# Altium project VESC.PrjPCB
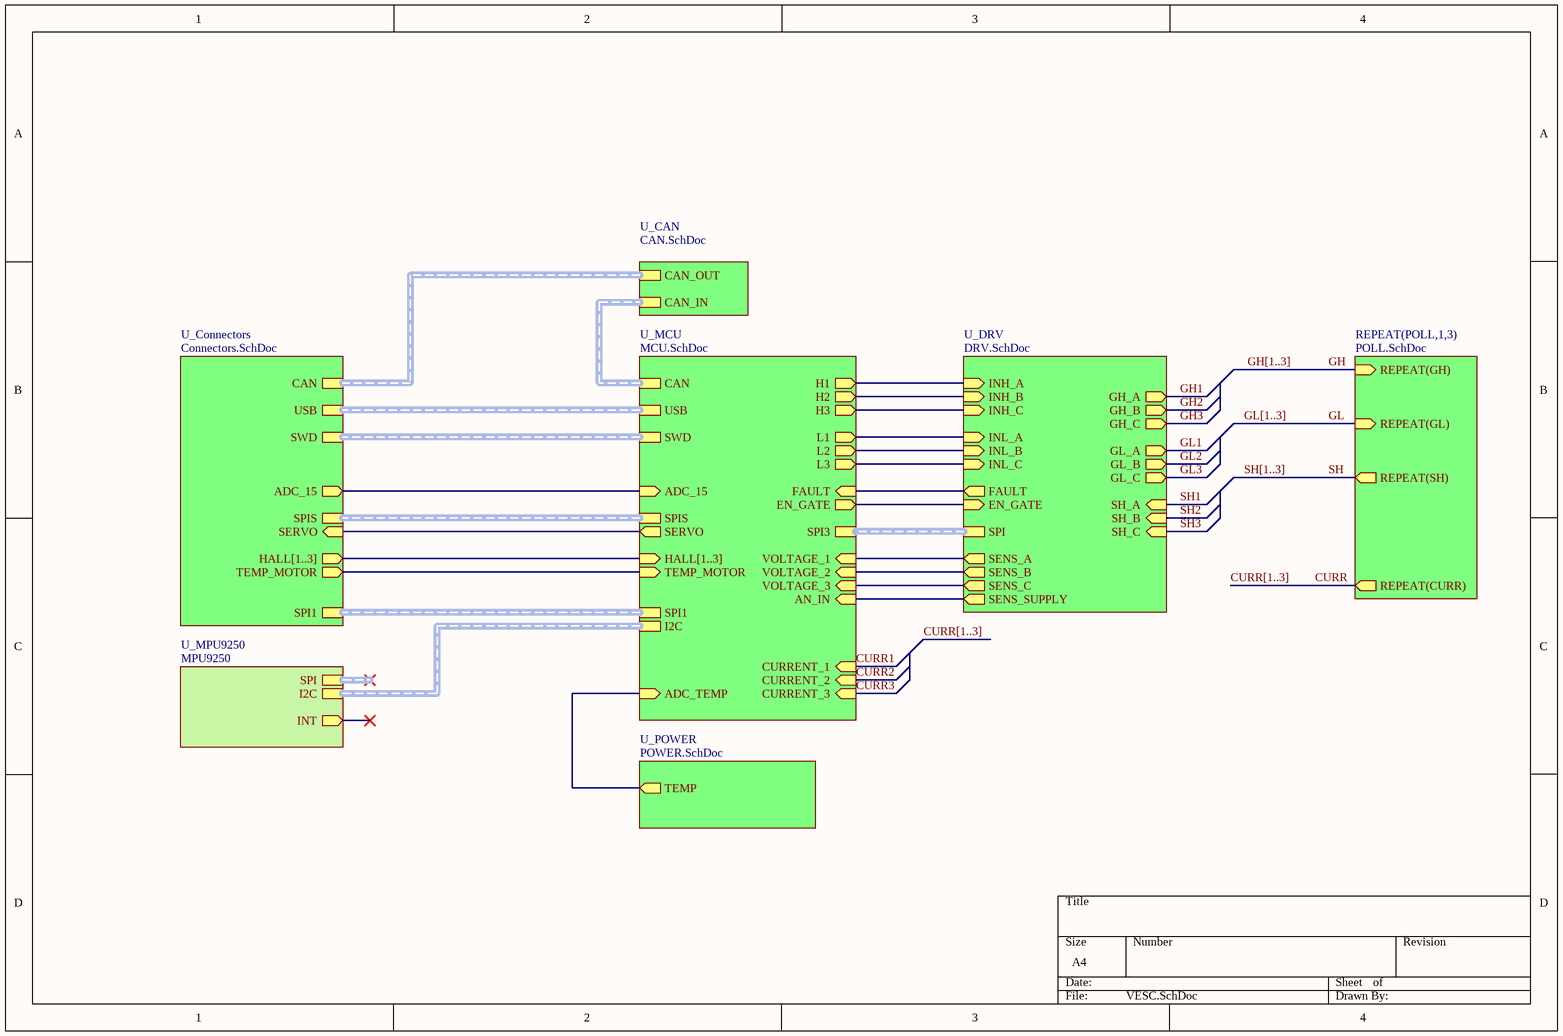
[diagram p0: VESC.SchDoc]
7 sheets, 124 parts. Net scope: hierarchical (ports join the sheet entries above them; power ports are global).
Board file: Vesc.PcbDoc
Sheets:
  VESC.SchDoc
    U_MCU = MCU.SchDoc
    U_DRV = DRV.SchDoc
    POLL1 = POLL.SchDoc
    POLL2 = POLL.SchDoc
    POLL3 = POLL.SchDoc
    U_CAN = CAN.SchDoc
    U_Connectors = Connectors.SchDoc
    U_POWER = POWER.SchDoc

## Sheet VESC.SchDoc
size A4

### Sub-sheets
REPEAT(POLL,1,3) = POLL.SchDoc: REPEAT(GH) (in), REPEAT(GL) (in), REPEAT(SH) (out), REPEAT(CURR) (out)
U_CAN = CAN.SchDoc: CAN_IN (harness CAN Input), CAN_OUT (harness CAN Output)
U_Connectors = Connectors.SchDoc: SERVO (in), SWD, USB, CAN (harness CAN Output), SPI1 (harness SPI), ADC_15 (out), HALL[1..3] (out), TEMP_MOTOR (out), SPIS (harness SPI)
U_DRV = DRV.SchDoc: INH_A (in), INH_B (in), INH_C (in), INL_A (in), INL_B (in), INL_C (in), SPI (harness SPI), SENS_A (out), SENS_B (out), SENS_C (out), SENS_SUPPLY (out), EN_GATE (in), FAULT (out), GH_A (out), GH_B (out), GH_C (out), GL_A (out), GL_B (out), GL_C (out), SH_A (in), SH_B (in), SH_C (in)
U_MCU = MCU.SchDoc: SERVO (out), SPI1 (harness SPI), SWD (harness SWD), USB (harness USB), CAN (harness CAN Input), H1 (out), H2 (out), H3 (out), L1 (out), L2 (out), L3 (out), FAULT (in), EN_GATE (out), VOLTAGE_1 (in), VOLTAGE_2 (in), VOLTAGE_3 (in), AN_IN (in), SPI3 (harness SPI), ADC_15 (in), HALL[1..3] (in), TEMP_MOTOR (in), CURRENT_1 (in), CURRENT_2 (in), CURRENT_3 (in), SPIS (harness SPI), ADC_TEMP (in), I2C (harness I2C)
U_MPU9250 = MPU9250 (file not in this document): INT (out), SPI (harness SPI), I2C (harness SPI)
U_POWER = POWER.SchDoc: TEMP (out)

### Nets
CURR: sheet REPEAT(POLL,1,3)/REPEAT(CURR)
GH: sheet REPEAT(POLL,1,3)/REPEAT(GH)
GL: sheet REPEAT(POLL,1,3)/REPEAT(GL)
SH: sheet REPEAT(POLL,1,3)/REPEAT(SH)
NetC36_2: sheet U_MCU/ADC_TEMP, sheet U_POWER/TEMP
NetC58_1: sheet U_MCU/TEMP_MOTOR, sheet U_Connectors/TEMP_MOTOR
NetJP4_8: sheet U_MCU/ADC_15, sheet U_Connectors/ADC_15
NetJP6_3: sheet U_MCU/SERVO, sheet U_Connectors/SERVO
NetR15_1: sheet U_MCU/AN_IN, sheet U_DRV/SENS_SUPPLY
NetR17_1: sheet U_MCU/VOLTAGE_1, sheet U_DRV/SENS_A
NetR19_1: sheet U_MCU/VOLTAGE_2, sheet U_DRV/SENS_B
NetR21_1: sheet U_MCU/VOLTAGE_3, sheet U_DRV/SENS_C
NetU1_34: sheet U_MCU/L1, sheet U_DRV/INL_A
NetU1_35: sheet U_MCU/L2, sheet U_DRV/INL_B
NetU1_36: sheet U_MCU/L3, sheet U_DRV/INL_C
NetU1_41: sheet U_MCU/H1, sheet U_DRV/INH_A
NetU1_42: sheet U_MCU/H2, sheet U_DRV/INH_B
NetU1_43: sheet U_MCU/H3, sheet U_DRV/INH_C
NetU1_57: sheet U_MCU/EN_GATE, sheet U_DRV/EN_GATE
NetU1_59: sheet U_MCU/FAULT, sheet U_DRV/FAULT

### Buses and harness runs
bus CURR[1..3]
bus GH[1..3]
bus GL[1..3]
bus SH[1..3]
bus sheet U_Connectors/HALL[1..3] = sheet U_MCU/HALL[1..3]
harness sheet U_CAN/CAN_IN = sheet U_MCU/CAN
harness sheet U_CAN/CAN_OUT = sheet U_Connectors/CAN
harness sheet U_Connectors/SPI1 = sheet U_MCU/SPI1
harness sheet U_Connectors/SPIS = sheet U_MCU/SPIS
harness sheet U_Connectors/SWD = sheet U_MCU/SWD
harness sheet U_Connectors/USB = sheet U_MCU/USB
harness sheet U_DRV/SPI = sheet U_MCU/SPI3
harness sheet U_MCU/I2C = sheet U_MPU9250/I2C

## Sheet MCU.SchDoc
size A4
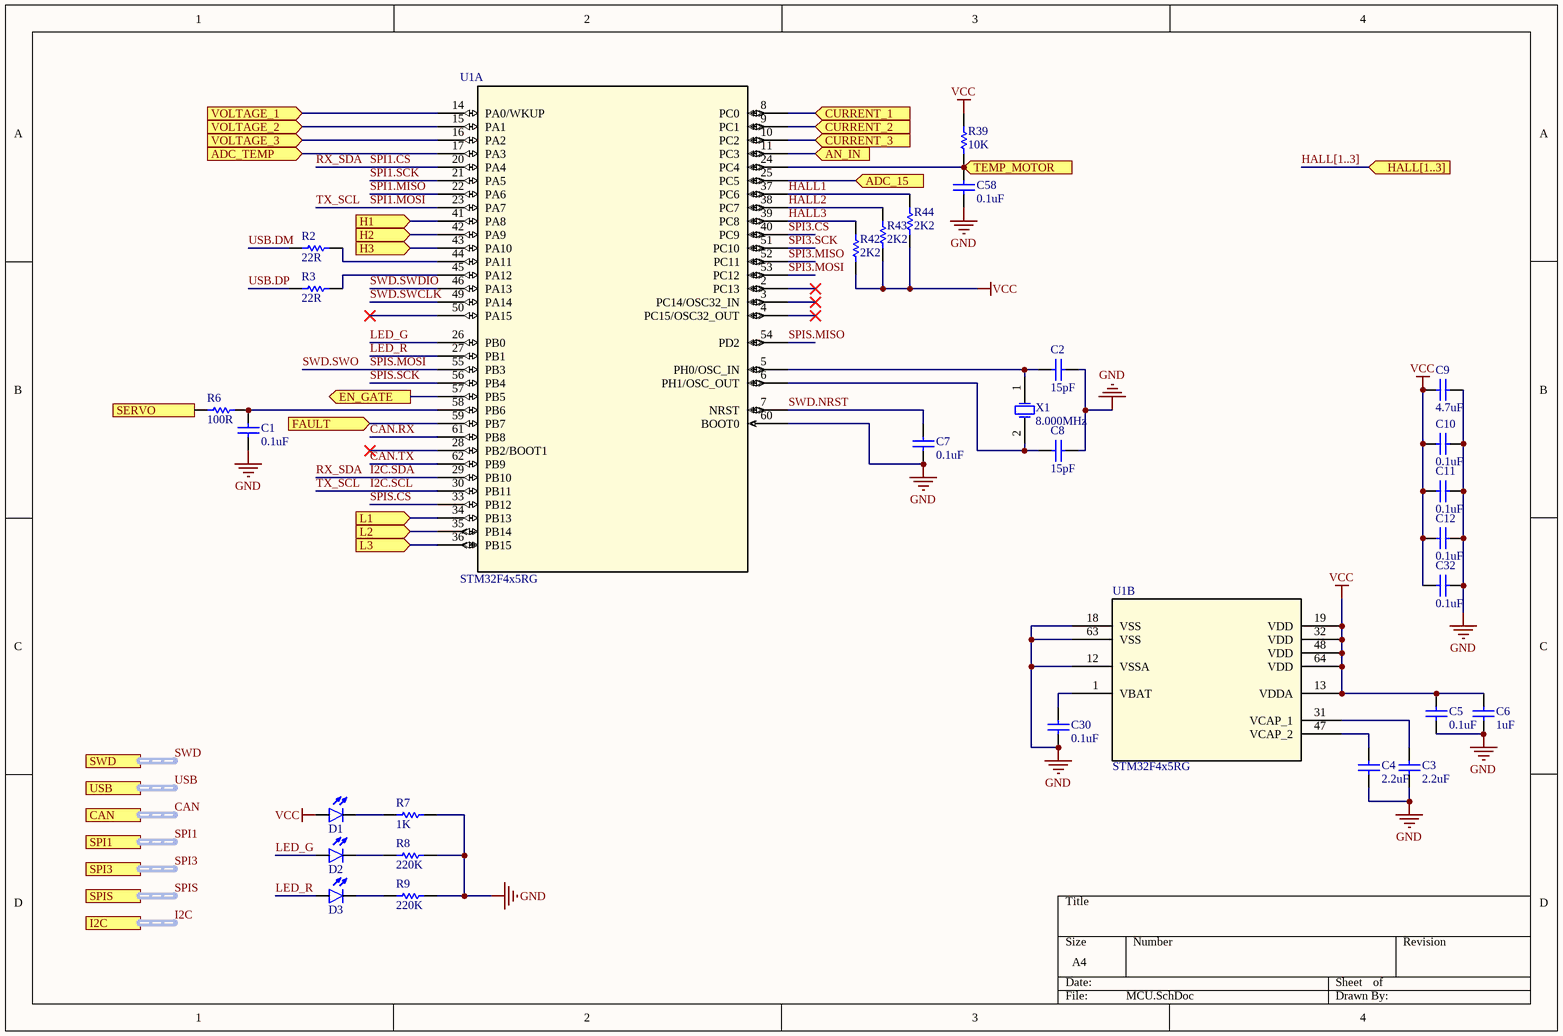
[diagram p1: MCU.SchDoc]

### Parts
C1  value 0.1uF  [C0603[1608X92]]  (hidden comment: 0.1uF 16V 0603)
C2  value 15pF  [C0603[1608X92]]  (hidden comment: 15pF 6.3V 0603)
C3  value 2.2uF  [C1206[3216X160]]  (hidden comment: 2.2uF 6.3V 1206)
C4  value 2.2uF  [C1206[3216X160]]  (hidden comment: 2.2uF 6.3V 1206)
C5  value 0.1uF  [C0603[1608X92]]  (hidden comment: 0.1uF 6.3V 0603)
C6  value 1uF  [C0603[1608X92]]  (hidden comment: 1uF 6.3V 0603)
C7  value 0.1uF  [C0603[1608X92]]  (hidden comment: 0.1uF 6.3V 0603)
C8  value 15pF  [C0603[1608X92]]  (hidden comment: 15pF 6.3V 0603)
C9  value 4.7uF  [C0603[1608X92]]  (hidden comment: 4.7uF 6.3V 0603)
C10  value 0.1uF  [C0603[1608X92]]  (hidden comment: 0.1uF 6.3V 0603)
C11  value 0.1uF  [C0603[1608X92]]  (hidden comment: 0.1uF 6.3V 0603)
C12  value 0.1uF  [C0603[1608X92]]  (hidden comment: 0.1uF 6.3V 0603)
C30  value 0.1uF  [C0603[1608X92]]  (hidden comment: 0.1uF 6.3V 0603)
C32  value 0.1uF  [C0603[1608X92]]  (hidden comment: 0.1uF 6.3V 0603)
C58  value 0.1uF  [C0603[1608X92]]  (hidden comment: 0.1uF 6.3V 0603)
D1  LED_0603_BLUE_5mA  [LED0603]  (value not drawn)
D2  LED_0603_GREEN_5mA  [LED0603]  (value not drawn)
D3  LED_0603_ORANGE_5mA  [LED0603]  (value not drawn)
R2  value 22R  [R0603[1608]]  (hidden comment: 22R 1% 0603)
R3  value 22R  [R0603[1608]]  (hidden comment: 22R 1% 0603)
R6  value 100R  [R0603[1608]]  (hidden comment: 100R 1% 0603)
R7  value 1K  [R0603[1608]]  (hidden comment: 1K 1% 0603)
R8  value 220K  [R0603[1608]]  (hidden comment: 220K 1% 0603)
R9  value 220K  [R0603[1608]]  (hidden comment: 220K 1% 0603)
R39  value 10K  [R0603[1608]]  (hidden comment: 10K 1% 0603)
R42  value 2K2  [R0603[1608]]  (hidden comment: 2K2 1% 0603)
R43  value 2K2  [R0603[1608]]  (hidden comment: 2K2 1% 0603)
R44  value 2K2  [R0603[1608]]  (hidden comment: 2K2 1% 0603)
U1  STM32F4x5RG  [LQFP64-10x10mm]  (parts A,B of 2)
X1  8.000MHz  [OSC_2SM_3R2x2R5]

### Ports
ADC_15 (in), ADC_TEMP (in), AN_IN (in), CAN (harness CAN Input), CURRENT_1 (in), CURRENT_2 (in), CURRENT_3 (in), EN_GATE (out), FAULT (in), H1 (in), H2 (in), H3 (in), HALL[1..3] (in), I2C (harness I2C), L1 (in), L2 (in), L3 (in), SERVO (out), SPI1 (harness SPI), SPI3 (harness SPI), SPIS (harness SPI), SWD (harness SWD), TEMP_MOTOR (in), USB (harness USB), VOLTAGE_1 (in), VOLTAGE_2 (in), VOLTAGE_3 (in)

### Nets
GND: C1.1 C2.2 C3.1 C4.1 C5.2 C6.2 C7.2 C8.2 C9.2 C10.2 C11.2 C12.2 C30.1 C32.2 C58.2 R7.2 R8.2 R9.2 U1.12(VSSA) U1.18(VSS) U1.60(BOOT0) U1.63(VSS)
VCC: C5.1 C6.1 C9.1 C10.1 C11.1 C12.1 C32.1 D1.A R39.2 R42.1 R43.1 R44.1 U1.13(VDDA) U1.19(VDD) U1.32(VDD) U1.48(VDD) U1.64(VDD)
CAN.RX: U1.61(PB8)
CAN.TX: U1.62(PB9)
CURR1: U1.8(PC0) ; port CURRENT_1
CURR2: U1.9(PC1) ; port CURRENT_2
CURR3: U1.10(PC2) ; port CURRENT_3
HALL1: R44.2 U1.37(PC6)
HALL2: R43.2 U1.38(PC7)
HALL3: R42.2 U1.39(PC8)
I2C.SCL: U1.23(PA7) U1.30(PB11)  [also labelled SPI1.MOSI, TX_SCL]
I2C.SDA: U1.20(PA4) U1.29(PB10)  [also labelled RX_SDA, SPI1.CS]
LED_G: D2.A U1.26(PB0)
LED_R: D3.A U1.27(PB1)
SPI1.MISO: U1.22(PA6)
SPI1.SCK: U1.21(PA5)
SPI3.CS: U1.40(PC9)
SPI3.MISO: U1.52(PC11)
SPI3.MOSI: U1.53(PC12)
SPI3.SCK: U1.51(PC10)
SPIS.CS: U1.33(PB12)
SPIS.MISO: U1.54(PD2)
SPIS.MOSI: U1.55(PB3)  [also labelled SWD.SWO]
SPIS.SCK: U1.56(PB4)
SWD.NRST: C7.1 U1.7(NRST)
SWD.SWCLK: U1.49(PA14)
SWD.SWDIO: U1.46(PA13)
USB.DM: R2.1
USB.DP: R3.1
NetC1_2: C1.2 R6.2 U1.58(PB6)
NetC2_1: C2.1 U1.5(PH0/OSC_IN) X1.1(OSC1)
NetC3_2: C3.2 U1.31(VCAP_1)
NetC4_2: C4.2 U1.47(VCAP_2)
NetC8_1: C8.1 U1.6(PH1/OSC_OUT) X1.2(OSC2)
NetC30_2: C30.2 U1.1(VBAT)
NetC36_2: U1.17(PA3) ; port ADC_TEMP
NetC58_1: C58.1 R39.1 U1.24(PC4) ; port TEMP_MOTOR
NetD1_C: D1.C R7.1
NetD2_C: D2.C R8.1
NetD3_C: D3.C R9.1
NetJP4_8: U1.25(PC5) ; port ADC_15
NetJP6_3: R6.1 ; port SERVO
NetR2_2: R2.2 U1.44(PA11)
NetR3_2: R3.2 U1.45(PA12)
NetR15_1: U1.11(PC3) ; port AN_IN
NetR17_1: U1.14(PA0/WKUP) ; port VOLTAGE_1
NetR19_1: U1.15(PA1) ; port VOLTAGE_2
NetR21_1: U1.16(PA2) ; port VOLTAGE_3
NetU1_34: U1.34(PB13) ; port L1
NetU1_35: U1.35(PB14) ; port L2
NetU1_36: U1.36(PB15) ; port L3
NetU1_41: U1.41(PA8) ; port H1
NetU1_42: U1.42(PA9) ; port H2
NetU1_43: U1.43(PA10) ; port H3
NetU1_57: U1.57(PB5) ; port EN_GATE
NetU1_59: U1.59(PB7) ; port FAULT

Not connected (* = marked no-connect by the designer): U1 2(PC13)* 3(PC14/OSC32_IN)* 4(PC15/OSC32_OUT)* 28(PB2/BOOT1)* 50(PA15)*

### Buses and harness runs
bus HALL[1..3] = port HALL[1..3]
harness CAN = port CAN
harness I2C = port I2C
harness SPI1 = port SPI1
harness SPI3 = port SPI3
harness SPIS = port SPIS
harness SWD = port SWD
harness USB = port USB

### Library data of the parts
C1 = CAP_0.1uF_16V_0603_10%: 0.1uF 16V 10% 0603 (1608 Metric); PartNumber: GCM188R71C104KA37D; Manufacturer: Murata; TemperatureCoefficient: X7R; Mounting Technology: Surface Mount; PackageReference: 0603; PackageDescription: 0603 (1608 Metric); Voltage: 16V; Tolerance: 10%
C2 C8 = CAP_15pF_6.3V_0603_1%: 15pF 6.3V 1% 0603 (1608 Metric); PartNumber: CBR02C150F9GAC; Manufacturer: KEMET; TemperatureCoefficient: C0G; Mounting Technology: Surface Mount; PackageReference: 0603; PackageDescription: 0603 (1608 Metric); Voltage: 6.3V; Tolerance: 1%
C3 C4 = CAP_2.2uF_16V_1206_10%: 2.2uF 6.3V 10% 1206 (3216 Metric); PartNumber: GRM31CR60J476KE19L; Manufacturer: Murata; Voltage: 16V; Mounting Technology: Surface Mount; PackageReference: 1206; PackageDescription: 1206 (3216 Metric); Tolerance: 10%
C5 C7 C10-C12 C30 C32 C58 = CAP_0.1uF_6.3V_0603_10%: 0.1uF 6.3V 10% 0603 (1608 Metric); PartNumber: GRM188R70J104KA01D; Manufacturer: Murata; Mounting Technology: Surface Mount; PackageReference: 0603; PackageDescription: 0603 (1608 Metric); Voltage: 6.3V; Tolerance: 10%
C6 = CAP_1uF_6.3V_0603_10%: 1uF 6.3V 10% 0603 (1608 Metric); PartNumber: GRM188R60J105KA01D; Manufacturer: Murata; TemperatureCoefficient: X5R; Mounting Technology: Surface Mount; PackageReference: 0603; PackageDescription: 0603 (1608 Metric); Voltage: 6.3V; Tolerance: 10%
C9 = CAP_4.7uF_6.3V_0603_10%: 4.7uF 6.3V 10% 0603 (1608 Metric); PartNumber: GRM188R60J475KE19D; Manufacturer: Murata; TemperatureCoefficient: X5R; Mounting Technology: Surface Mount; PackageReference: 0603; PackageDescription: 0603 (1608 Metric); Voltage: 6.3V; Tolerance: 10%
D1 = LED_0603_BLUE_5mA: PartNumber: LTST-C193TBKT-5A; Manufacturer: Lite-On Inc.; PackageReference: 0603; PackageDescription: 0603 (1608 Metric); Mounting Technology: Surface Mount
D2 = LED_0603_GREEN_5mA: PartNumber: LTST-C193TGKT-5A; Manufacturer: Lite-On Inc.; PackageReference: 0603; PackageDescription: 0603 (1608 Metric); Mounting Technology: Surface Mount
D3 = LED_0603_ORANGE_5mA: PartNumber: LTST-C193KFKT-5A; Manufacturer: Lite-On Inc.; PackageReference: 0603; PackageDescription: 0603 (1608 Metric); Mounting Technology: Surface Mount
R2 R3 = RES_22R_0603_1%: 22R 0.25W 1% 0603 (1005 Metric); Manufacturer: Vishay / Dale; PartNumber: CRCW060322R0FKEAHP; Tolerance: 1%; Power: 0.25W; Mounting Technology: Surface Mount; PackageReference: 0603; PackageDescription: 0603 (1608 Metric); ComponentLink1Description: Datasheet; ComponentLink1URL: http://www.vishay.com/docs/20043/crcwhpe3.pdf
R6 = RES_100R_0603_1%: 100R 0.25W 1% 0603 (1005 Metric); Manufacturer: Vishay / Dale; PartNumber: CRCW0603100RFKEAHP; Tolerance: 1%; Power: 0.25W; Mounting Technology: Surface Mount; PackageReference: 0603; PackageDescription: 0603 (1608 Metric); ComponentLink1Description: Datasheet; ComponentLink1URL: http://www.vishay.com/docs/20043/crcwhpe3.pdf
R7 = RES_1K_0603_1%: 1K 0.25W 1% 0603 (1005 Metric); Manufacturer: Vishay / Dale; PartNumber: CRCW06031K00FKEAHP; Tolerance: 1%; Power: 0.25W; Mounting Technology: Surface Mount; PackageReference: 0603; PackageDescription: 0603 (1608 Metric); ComponentLink1Description: Datasheet; ComponentLink1URL: http://www.vishay.com/docs/20043/crcwhpe3.pdf
R8 R9 = RES_220K_0603_1%: 220K 0.25W 1% 0603 (1005 Metric); Manufacturer: Vishay / Dale; PartNumber: CRCW0603220KJNEAHP; Tolerance: 1%; Power: 0.25W; Mounting Technology: Surface Mount; PackageReference: 0603; PackageDescription: 0603 (1608 Metric); ComponentLink1Description: Datasheet; ComponentLink1URL: http://www.vishay.com/docs/20043/crcwhpe3.pdf
R39 = RES_10K_0603_1%: 10K 0.25W 1% 0603 (1005 Metric); Manufacturer: Vishay; PartNumber: RCS060310K0FKEA; Tolerance: 1%; Power: 0.25W; Mounting Technology: Surface Mount; PackageReference: 0603; PackageDescription: 0603 (1608 Metric); ComponentLink1Description: Datasheet; ComponentLink1URL: http://www.vishay.com/docs/20065/rcse3.pdf
R42-R44 = RES_2K2_0603_1%: 2K2 0.25W 1% 0603 (1005 Metric); Manufacturer: Vishay / Dale; PartNumber: CRCW06032K20FKEAHP; Tolerance: 1%; Power: 0.25W; Mounting Technology: Surface Mount; PackageReference: 0603; PackageDescription: 0603 (1608 Metric); ComponentLink1Description: Datasheet; ComponentLink1URL: http://www.vishay.com/docs/20043/crcwhpe3.pdf
U1 = STM32F4x5RG: Imported; PartNumber: STM32F405RG; Vendor: STMicroelectronics; Value: Value; Type: Type; RefDes: RefDes; Manufacturer: STMicroelectronics
X1 = XTAL: Crystal Oscillator; Manufacturer: NX; PartNumber: NX3225GD-8.000M-EXS00A-CG04874; PackageReference: R38; Value: 8.000MHz

## Sheet DRV.SchDoc
size A4
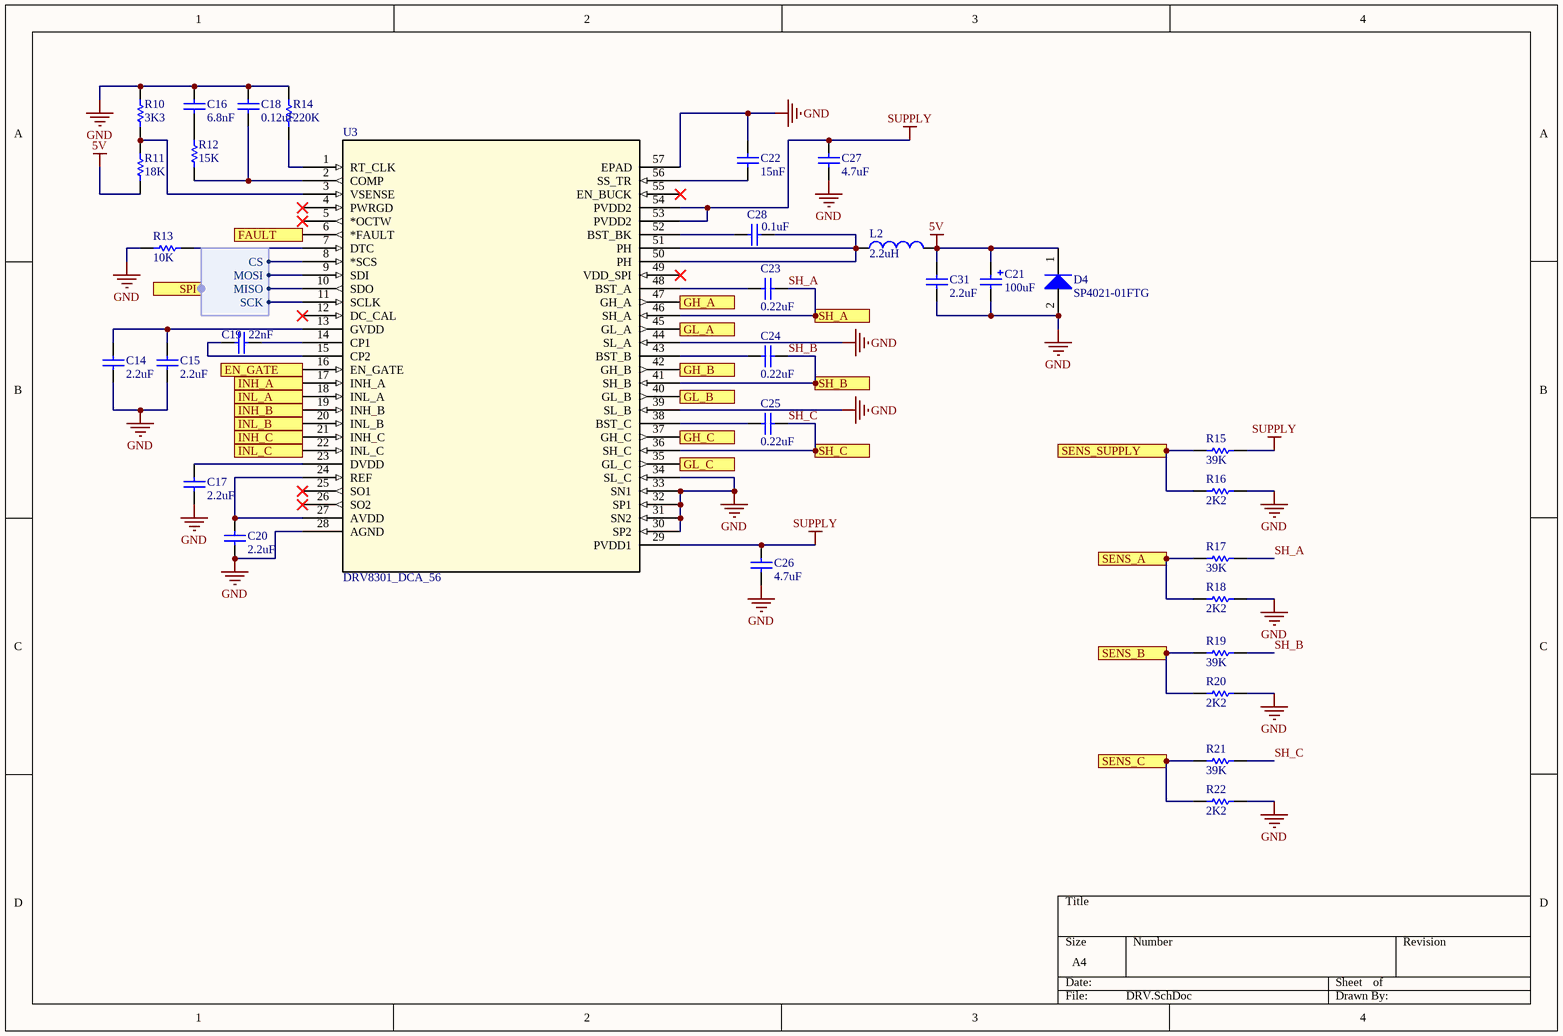
[diagram p2: DRV.SchDoc]

### Parts
C14  value 2.2uF  [C0603[1608X92]]  (hidden comment: 2.2uF 25V 0603)
C15  value 2.2uF  [C0603[1608X92]]  (hidden comment: 2.2uF 25V 0603)
C16  value 6.8nF  [C0603[1608X92]]  (hidden comment: 6.8nF 50V 0603)
C17  value 2.2uF  [C0603[1608X92]]  (hidden comment: 2.2uF 25V 0603)
C18  value 0.12uF  [C0603[1608X92]]  (hidden comment: 0.12uF 10V 0603)
C19  value 22nF  [C0603[1608X92]]  (hidden comment: 22nF 50V 0603)
C20  value 2.2uF  [C0603[1608X92]]  (hidden comment: 2.2uF 25V 0603)
C21  value 100uF  [C1206[3216X105]_Tantal]  (hidden comment: 100uF 16V 1206)
C22  value 15nF  [C0603[1608X92]]  (hidden comment: 15nF 50V 0603)
C23  value 0.22uF  [C0603[1608X92]]  (hidden comment: 0.22uF 50V 0603)
C24  value 0.22uF  [C0603[1608X92]]  (hidden comment: 0.22uF 50V 0603)
C25  value 0.22uF  [C0603[1608X92]]  (hidden comment: 0.22uF 50V 0603)
C26  value 4.7uF  [C1210[3225X200]]  (hidden comment: 4.7uF 100V 1210)
C27  value 4.7uF  [C1210[3225X200]]  (hidden comment: 4.7uF 100V 1210)
C28  value 0.1uF  [C0603[1608X92]]  (hidden comment: 0.1uF 50V 0603)
C31  value 2.2uF  [C1206[3216X160]]  (hidden comment: 2.2uF 6.3V 1206)
D4  SP4021-01FTG  [SOD-323]
L2  value 2.2uH  [XAL8080]  (hidden comment: XAL8080-220ME_)
R10  value 3K3  [R0603[1608]]  (hidden comment: 4K7 1% 0603)
R11  value 18K  [R0603[1608]]  (hidden comment: 18K 1% 0603)
R12  value 15K  [R0603[1608]]  (hidden comment: 15K 1% 0603)
R13  value 10K  [R0603[1608]]  (hidden comment: 10K 1% 0603)
R14  value 220K  [R0603[1608]]  (hidden comment: 220K 1% 0603)
R15  value 39K  [R0603[1608]]  (hidden comment: 39K 1% 0603)
R16  value 2K2  [R0603[1608]]  (hidden comment: 2K2 1% 0603)
R17  value 39K  [R0603[1608]]  (hidden comment: 39K 1% 0603)
R18  value 2K2  [R0603[1608]]  (hidden comment: 2K2 1% 0603)
R19  value 39K  [R0603[1608]]  (hidden comment: 39K 1% 0603)
R20  value 2K2  [R0603[1608]]  (hidden comment: 2K2 1% 0603)
R21  value 39K  [R0603[1608]]  (hidden comment: 39K 1% 0603)
R22  value 2K2  [R0603[1608]]  (hidden comment: 2K2 1% 0603)
U3  DRV8301_DCA_56  [DCA56_6P35X3P61]

### Ports
EN_GATE (in), FAULT (out), GH_A (out), GH_B (out), GH_C (out), GL_A (out), GL_B (out), GL_C (out), INH_A (in), INH_B (in), INH_C (in), INL_A (in), INL_B (in), INL_C (in), SENS_A (out), SENS_B (out), SENS_C (out), SENS_SUPPLY (out), SH_A (in), SH_B (in), SH_C (in), SPI (harness SPI)

### Harnesses
SPI: SCK, MOSI, MISO, CS

### Nets
5V: C21.1 C31.1 D4.1(K) L2.2 R11.1
GND: C14.1 C15.1 C16.2 C17.1 C18.2 C20.1 C21.2 C22.2 C26.1 C27.2 C31.2 D4.2(A) R10.2 R13.1 R14.2 R16.2 R18.2 R20.2 R22.2 U3.28(AGND) U3.30(SP2) U3.31(SN2) U3.32(SP1) U3.33(SN1) U3.34(SL_C) U3.39(SL_B) U3.44(SL_A) U3.57(EPAD)
SUPPLY: C26.2 C27.1 R15.2 U3.29(PVDD1) U3.53(PVDD2) U3.54(PVDD2)
GH1: U3.47(GH_A) ; port GH_A
GH2: U3.42(GH_B) ; port GH_B
GH3: U3.37(GH_C) ; port GH_C
GL1: U3.45(GL_A) ; port GL_A
GL2: U3.40(GL_B) ; port GL_B
GL3: U3.35(GL_C) ; port GL_C
SH_A: C23.2 R17.2 U3.46(SH_A) ; port SH_A  [project net SH1]
SH_B: C24.2 R19.2 U3.41(SH_B) ; port SH_B  [project net SH2]
SH_C: C25.2 R21.2 U3.36(SH_C) ; port SH_C  [project net SH3]
SPI3.CS: U3.8(*SCS) ; port SPI.CS
SPI3.MISO: U3.10(SDO) ; port SPI.MISO
SPI3.MOSI: U3.9(SDI) ; port SPI.MOSI
SPI3.SCK: U3.11(SCLK) ; port SPI.SCK
NetC14_2: C14.2 C15.2 U3.13(GVDD)
NetC16_1: C16.1 R12.2
NetC17_2: C17.2 U3.23(DVDD)
NetC18_1: C18.1 R12.1 U3.2(COMP)
NetC19_1: C19.1 U3.14(CP1)
NetC19_2: C19.2 U3.15(CP2)
NetC20_2: C20.2 U3.24(REF) U3.27(AVDD)
NetC22_1: C22.1 U3.56(SS_TR)
NetC23_1: C23.1 U3.48(BST_A)
NetC24_1: C24.1 U3.43(BST_B)
NetC25_1: C25.1 U3.38(BST_C)
NetC28_1: C28.1 L2.1 U3.50(PH) U3.51(PH)
NetC28_2: C28.2 U3.52(BST_BK)
NetR10_1: R10.1 R11.2 U3.3(VSENSE)
NetR13_2: R13.2 U3.7(DTC)
NetR14_1: R14.1 U3.1(RT_CLK)
NetR15_1: R15.1 R16.1 ; port SENS_SUPPLY
NetR17_1: R17.1 R18.1 ; port SENS_A
NetR19_1: R19.1 R20.1 ; port SENS_B
NetR21_1: R21.1 R22.1 ; port SENS_C
NetU1_34: U3.18(INL_A) ; port INL_A
NetU1_35: U3.20(INL_B) ; port INL_B
NetU1_36: U3.22(INL_C) ; port INL_C
NetU1_41: U3.17(INH_A) ; port INH_A
NetU1_42: U3.19(INH_B) ; port INH_B
NetU1_43: U3.21(INH_C) ; port INH_C
NetU1_57: U3.16(EN_GATE) ; port EN_GATE
NetU1_59: U3.6(*FAULT) ; port FAULT

Not connected (* = marked no-connect by the designer): U3 4(PWRGD)* 5(*OCTW)* 12(DC_CAL)* 25(SO1)* 26(SO2)* 49(VDD_SPI)* 55(EN_BUCK)*

### Library data of the parts
C14 C15 C17 C20 = CAP_2.2uF_25V_0603_10%: 2.2uF 25V 10% 0603 (1608 Metric); PartNumber: GRM188R61E225KA12D; Manufacturer: Murata; TemperatureCoefficient: X5R; Mounting Technology: Surface Mount; PackageReference: 0603; PackageDescription: 0603 (1608 Metric); Voltage: 25V; Tolerance: 10%
C16 = CAP_6.8nF_50V_0603_5%: 6.8nF 50V 5% 0603 (1608 Metric); PartNumber: GRM1885C1H682JA01D; Manufacturer: Murata; TemperatureCoefficient: C0G; Mounting Technology: Surface Mount; PackageReference: 0603; PackageDescription: 0603 (1608 Metric); Voltage: 50V; Tolerance: 5%
C18 = CAP_0.12uF_10V_0603_10%: 0.12uF 10V 10% 0603 (1608 Metric); PartNumber: GRM188R71A124KA01D; Manufacturer: Murata; TemperatureCoefficient: X7R; Mounting Technology: Surface Mount; PackageReference: 0603; PackageDescription: 0603 (1608 Metric); Voltage: 10V; Tolerance: 10%
C19 = CAP_22nF_50V_0603_10%: 22nF 50V 10% 0603 (1608 Metric); PartNumber: GRM188R71H223KA01D; Manufacturer: Murata; TemperatureCoefficient: X7R; Mounting Technology: Surface Mount; PackageReference: 0603; PackageDescription: 0603 (1608 Metric); Voltage: 50V; Tolerance: 10%
C21 = CAP_100uF_16V_1206_20%: TANTAL 100uF 16V 20% 1206 (3216 Metric); PartNumber: F931C107MCCAJ6; Manufacturer: AVX Corporation; Mounting Technology: Surface Mount; PackageReference: 1206; PackageDescription: 1206 (3216 Metric); Voltage: 16V; Tolerance: 20%
C22 = CAP_15nF_50V_0603_5%: 15nF 50V 5% 0603 (1608 Metric); PartNumber: GRM188R71H153JA01D; Manufacturer: Murata; TemperatureCoefficient: X7R; Mounting Technology: Surface Mount; PackageReference: 0603; PackageDescription: 0603 (1608 Metric); Voltage: 50V; Tolerance: 5%
C23-C25 = CAP_0.22uF_50V_0603_10%: 0.22uF 50V 10% 0603 (1608 Metric); PartNumber: GRM188R61H224KAC4D; Manufacturer: Murata; TemperatureCoefficient: X7R; Mounting Technology: Surface Mount; PackageReference: 0603; PackageDescription: 0603 (1608 Metric); Voltage: 50V; Tolerance: 10%
C26 C27 = CAP_4.7uF_100V_1210_10%: 4.7uF 100V 10% 1210 (3225 Metric); PartNumber: GRJ32DC72A475KE11L; Manufacturer: Murata; Mounting Technology: Surface Mount; PackageReference: 1210; PackageDescription: 1210 (3225 Metric); Voltage: 100V; Tolerance: 10%
C28 = CAP_0.1uF_50V_0603_10%: 0.1uF 50V 10% 0603 (1608 Metric); PartNumber: GCM188R71H104KA57D; Manufacturer: Murata; TemperatureCoefficient: X7R; Mounting Technology: Surface Mount; PackageReference: 0603; PackageDescription: 0603 (1608 Metric); Voltage: 50V; Tolerance: 10%
C31 = CAP_2.2uF_16V_1206_10%: as C3 on sheet MCU; Mounting Technology: Surface Mount; PackageReference: 1206; PackageDescription: 1206 (3216 Metric); Tolerance: 10%
D4 = SP4021-01FTG: Manufacturer: Littelfuse; PartNumber: SP4021-01FTG; PackageReference: SOD-323-2; Mounting Technology: Surface Mount
L2 = XAL8080-220ME_: 2.2uH 38A 4.08mOhms; PartNumber: XAL8080-270MED; Manufacturer: Coilcraft; Published: 8-Jun-2000; PackageReference: 0402-A; Publisher: Altium Limited; PackageDescription: Chip Inductor
R10 = RES_3K3_0603_1%: 3K3 0.25W 1% 0603 (1005 Metric); Manufacturer: Vishay / Dale; PartNumber: CRCW06033K30FKEAHP; Tolerance: 1%; Power: 0.25W; Mounting Technology: Surface Mount; PackageReference: 0603; PackageDescription: 0603 (1608 Metric); ComponentLink1Description: Datasheet; ComponentLink1URL: http://www.vishay.com/docs/20043/crcwhpe3.pdf
R11 = RES_18K_0603_1%: 18K 0.25W 1% 0603 (1005 Metric); Manufacturer: Vishay / Dale; PartNumber: CRCW060318K0FKEAHP; Tolerance: 1%; Power: 0.25W; Mounting Technology: Surface Mount; PackageReference: 0603; PackageDescription: 0603 (1608 Metric); ComponentLink1Description: Datasheet; ComponentLink1URL: http://www.vishay.com/docs/20043/crcwhpe3.pdf
R12 = RES_15K_0603_1%: 15K 0.25W 1% 0603 (1005 Metric); Manufacturer: Vishay / Dale; PartNumber: CRCW060315K0FKEAHP; Tolerance: 1%; Power: 0.25W; Mounting Technology: Surface Mount; PackageReference: 0603; PackageDescription: 0603 (1608 Metric); ComponentLink1Description: Datasheet; ComponentLink1URL: http://www.vishay.com/docs/20043/crcwhpe3.pdf
R13 = RES_10K_0603_1%: as R39 on sheet MCU; Tolerance: 1%; Power: 0.25W; Mounting Technology: Surface Mount; PackageReference: 0603; PackageDescription: 0603 (1608 Metric); ComponentLink1Description: Datasheet; ComponentLink1URL: http://www.vishay.com/docs/20065/rcse3.pdf
R14 = RES_220K_0603_1%: as R8 on sheet MCU; Tolerance: 1%; Power: 0.25W; Mounting Technology: Surface Mount; PackageReference: 0603; PackageDescription: 0603 (1608 Metric); ComponentLink1Description: Datasheet; ComponentLink1URL: http://www.vishay.com/docs/20043/crcwhpe3.pdf
R15 R17 R19 R21 = RES_39K_0603_1%: 39K 0.25W 1% 0603 (1005 Metric); Manufacturer: Vishay / Dale; PartNumber: CRCW060339K0FKEAHP; Tolerance: 1%; Power: 0.25W; Mounting Technology: Surface Mount; PackageReference: 0603; PackageDescription: 0603 (1608 Metric); ComponentLink1Description: Datasheet; ComponentLink1URL: http://www.vishay.com/docs/20043/crcwhpe3.pdf
R16 R18 R20 R22 = RES_2K2_0603_1%: as R42 on sheet MCU; Tolerance: 1%; Power: 0.25W; Mounting Technology: Surface Mount; PackageReference: 0603; PackageDescription: 0603 (1608 Metric); ComponentLink1Description: Datasheet; ComponentLink1URL: http://www.vishay.com/docs/20043/crcwhpe3.pdf
U3 = DRV8301_DCA_56: Imported; Manufacturer: Texas Instruments; FAMILY_NAME: 3-PHASE BRUSHLESS PRE-DRIVER; PIN_COUNT: 56; PACKAGE_DESIGNATOR: DCA; Datasheet_URL: http://www.ti.com/lit/gpn/DRV8301; GENERIC_PART_NUMBER: DRV8301; Vendor: Texas Instruments; Value: Value; Type: Type; RefDes: RefDes; PackageReference: HTSSOP; PartNumber: DRV8301_DCA

## Sheet POLL.SchDoc
size A4
Used 3 times, as channels POLL1, POLL2, POLL3. Parts and nets are listed once, with the designators drawn on the sheet.
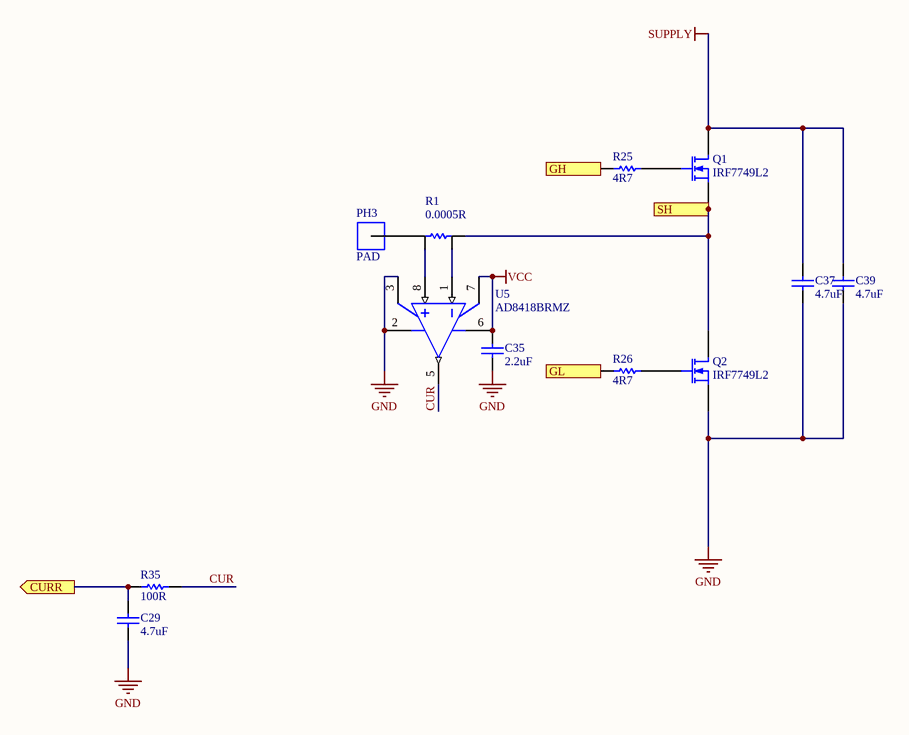
[diagram p3: POLL.SchDoc]

### Parts
C29  value 4.7uF  [C0603[1608X92]]  (hidden comment: 4.7uF 6.3V 0603)
C35  value 2.2uF  [C0603[1608X92]]  (hidden comment: 2.2uF 6.3V 0603)
C37  value 4.7uF  [C1210[3225X200]]  (hidden comment: 4.7uF 100V 1210)
C39  value 4.7uF  [C1210[3225X200]]  (hidden comment: 4.7uF 100V 1210)
PH3  PAD  [PAD]
Q1  IRF7749L2  [DIRECTFET-9]
Q2  IRF7749L2  [DIRECTFET-9]
R1  value 0.0005R  [LRMAP3920B]  (hidden comment: LRMAP3920B)
R25  value 4R7  [R0603[1608]]  (hidden comment: 4R7 1% 0603)
R26  value 4R7  [R0603[1608]]  (hidden comment: 4R7 1% 0603)
R35  value 100R  [R0603[1608]]  (hidden comment: 100R 1% 0603)
U5  AD8418BRMZ  [MSOP-8]

### Ports
CURR (out), GH (in), GL (in), SH

### Nets
GND: C29.1 C35.2 C37.1 C39.1 Q2.2(S) U5.2(GND) U5.3(VREF2)
SUPPLY: C37.2 C39.2 Q1.3(D)
VCC: C35.1 U5.6(VS) U5.7(VREF1)
CUR: R35.2 U5.5(OUT)
CURR: C29.2 R35.1 ; port CURR
GH: R25.1 ; port GH
GL: R26.1 ; port GL
SH: Q1.2(S) Q2.3(D) R1.2 ; port SH
NetPH3_0: PH3.0(PH) R1.1
NetQ1_1: Q1.1(G) R25.2
NetQ2_1: Q2.1(G) R26.2
NetR1_3: R1.3 U5.8(IN+)
NetR1_4: R1.4 U5.1(IN-)

### Channels
POLL1: designators C29=POLL1_C29 C35=POLL1_C35 C37=POLL1_C37 C39=POLL1_C39 PH3=POLL1_PH3 Q1=POLL1_Q1 Q2=POLL1_Q2 R1=POLL1_R1 R25=POLL1_R25 R26=POLL1_R26 R35=POLL1_R35 U5=POLL1_U5; ports CURR=CURR1 GH=GH1 GL=GL1 SH=SH1
POLL2: designators C29=POLL2_C29 C35=POLL2_C35 C37=POLL2_C37 C39=POLL2_C39 PH3=POLL2_PH3 Q1=POLL2_Q1 Q2=POLL2_Q2 R1=POLL2_R1 R25=POLL2_R25 R26=POLL2_R26 R35=POLL2_R35 U5=POLL2_U5; ports CURR=CURR2 GH=GH2 GL=GL2 SH=SH2
POLL3: designators C29=POLL3_C29 C35=POLL3_C35 C37=POLL3_C37 C39=POLL3_C39 PH3=POLL3_PH3 Q1=POLL3_Q1 Q2=POLL3_Q2 R1=POLL3_R1 R25=POLL3_R25 R26=POLL3_R26 R35=POLL3_R35 U5=POLL3_U5; ports CURR=CURR3 GH=GH3 GL=GL3 SH=SH3

### Library data of the parts
C29 = CAP_4.7uF_6.3V_0603_10%: as C9 on sheet MCU; Mounting Technology: Surface Mount; PackageReference: 0603; PackageDescription: 0603 (1608 Metric); Voltage: 6.3V; Tolerance: 10%
C35 = CAP_2.2uF_6.3V_0603_10%: 2.2uF 6.3V 10% 0603 (1608 Metric); PartNumber: GRM185R60J225KE26D; Manufacturer: Murata; TemperatureCoefficient: X5R; Mounting Technology: Surface Mount; PackageReference: 0603; PackageDescription: 0603 (1608 Metric); Voltage: 6.3V; Tolerance: 10%
C37 C39 = CAP_4.7uF_100V_1210_10%: as C26 on sheet DRV; Mounting Technology: Surface Mount; PackageReference: 1210; PackageDescription: 1210 (3225 Metric); Voltage: 100V; Tolerance: 10%
Q1 Q2 = IRF7749L2: N-Channel MOSFET; PartNumber: IRF7749L1TRPBF; Manufacturer: Infineon Technologies; PackageReference: DIRECTFET L8; PackageDescription: DirectFET™ Isometric L8; Mounting Technology: Surface Mount
R1 = LRMAP3920B: Current Sense Resistor, 0.0005R; Manufacturer: IRC / TT Electronics; Power: 5W; Tolerance: 1%; PartNumber: LRMAP3920B; PackageReference: 2726; Mounting Technology: Surface Mount
R25 R26 = RES_4R7_0603_1%: 4R7 0.25W 1% 0603 (1005 Metric); Manufacturer: Vishay / Dale; PartNumber: CRCW06034R70JNEAHP; Tolerance: 1%; Power: 0.25W; Mounting Technology: Surface Mount; PackageReference: 0603; PackageDescription: 0603 (1608 Metric); ComponentLink1Description: Datasheet; ComponentLink1URL: http://www.vishay.com/docs/20043/crcwhpe3.pdf
R35 = RES_100R_0603_1%: as R6 on sheet MCU; Tolerance: 1%; Power: 0.25W; Mounting Technology: Surface Mount; PackageReference: 0603; PackageDescription: 0603 (1608 Metric); ComponentLink1Description: Datasheet; ComponentLink1URL: http://www.vishay.com/docs/20043/crcwhpe3.pdf
U5 = AD8418BRMZ: Current Sense Amplifiers Zero Drift ,Precision Current Sense AMP; Manufacturer: Analog Devices; PartNumber: AD8418BRMZ; Mounting Technology: Surface Mount; PackageReference: MSOP-8; PackageDescription: SOP, 8-Leads, Body 3x3mm, Pitch 0.65mm, IPC Medium Density

## Sheet CAN.SchDoc
size A4
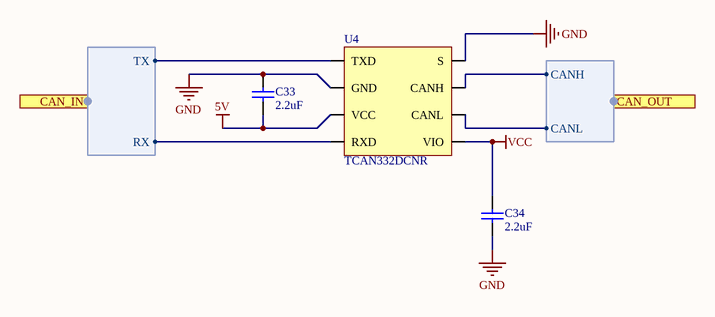
[diagram p4: CAN.SchDoc]

### Parts
C33  value 2.2uF  [C0603[1608X92]]  (hidden comment: 2.2uF 6.3V 0603)
C34  value 2.2uF  [C0603[1608X92]]  (hidden comment: 2.2uF 6.3V 0603)
U4  TCAN332DCNR  [SOT-23-8]

### Ports
CAN_IN (harness CAN Input), CAN_OUT (harness CAN Output)

### Harnesses
CAN Input: TX, RX
CAN Output: CANH, CANL

### Nets
5V: C33.1 U4.3(VCC)
GND: C33.2 C34.1 U4.2(GND) U4.8(S)
VCC: C34.2 U4.5(VIO)
CAN.RX: U4.4(RXD) ; port CAN_IN.RX
CAN.TX: U4.1(TXD) ; port CAN_IN.TX
NetJP2_2: U4.6(CANL) ; port CAN_OUT.CANL
NetJP2_3: U4.7(CANH) ; port CAN_OUT.CANH

### Library data of the parts
C33 C34 = CAP_2.2uF_6.3V_0603_10%: as C35 on sheet POLL; Mounting Technology: Surface Mount; PackageReference: 0603; PackageDescription: 0603 (1608 Metric); Voltage: 6.3V; Tolerance: 10%
U4 = TJA1051T/3: CAN Interface IC 5V CAN Transceivers 8-SOT-23 -40 to 150; Manufacturer: NXP Semiconductors; Mounting Technology: Surface Mount; PackageReference: SOT-23-8; PackageDescription: SOT23, 8-Leads; PartNumber: TJA1051T/3

## Sheet Connectors.SchDoc
size A4
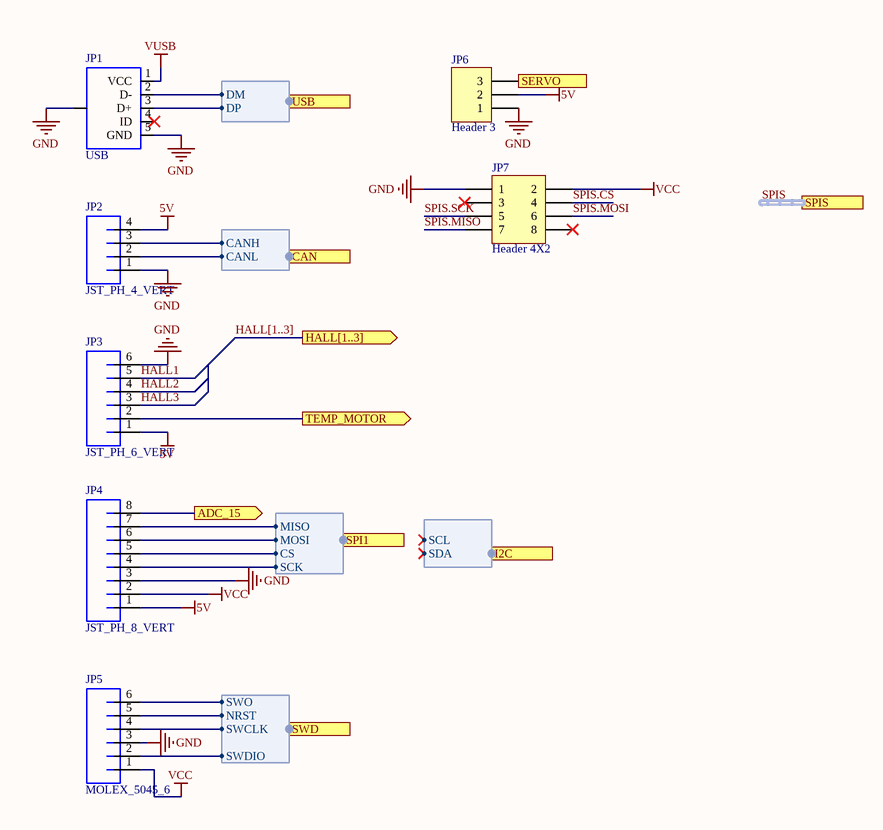
[diagram p5: Connectors.SchDoc]

### Parts
JP1  USB  [USB-MICROB_HORZ]
JP2  JST_PH_4_VERT  [JST-PH-4-PTH-VERT]
JP3  JST_PH_6_VERT  [JST-PH-6-PTH-VERT]
JP4  JST_PH_8_VERT  [JST-PH-8-PTH-VERT]
JP5  MOLEX_5045_6  [MOLEX_5045_6]
JP6  Header 3  [HDR1X3]
JP7  Header 4X2  [HDR2X4]

### Ports
ADC_15 (out), CAN (harness CAN Output), HALL[1..3] (out), I2C (harness I2C), SERVO (in), SPI1 (harness SPI), SPIS (harness SPI), SWD (harness SWD), TEMP_MOTOR (out), USB (harness USB)

### Harnesses
USB: DM, DP
CAN Output: CANL, CANH
SWD: SWCLK, SWDIO, SWO, NRST
SPI: CS, SCK, MISO, MOSI
I2C: SDA, SCL

### Nets
5V: JP2.4 JP3.1 JP4.1 JP6.2
GND: JP1.5(GND) JP1.6(SHIELD) JP2.1 JP3.6 JP4.3 JP5.3 JP6.1 JP7.1
VCC: JP4.2 JP5.1 JP7.2
VUSB: JP1.1(VCC)
HALL1: JP3.5
HALL2: JP3.4
HALL3: JP3.3
SPI1.CS: JP4.5 ; port SPI1.CS
SPI1.MISO: JP4.7 ; port SPI1.MISO
SPI1.MOSI: JP4.6 ; port SPI1.MOSI
SPI1.SCK: JP4.4 ; port SPI1.SCK
SPIS.CS: JP7.4
SPIS.MISO: JP7.7
SPIS.MOSI: JP7.6
SPIS.SCK: JP7.5
SWD.NRST: JP5.5 ; port SWD.NRST
SWD.SWCLK: JP5.4 ; port SWD.SWCLK
SWD.SWDIO: JP5.2 ; port SWD.SWDIO
SWD.SWO: JP5.6 ; port SWD.SWO
USB.DM: JP1.2(D-) ; port USB.DM
USB.DP: JP1.3(D+) ; port USB.DP
NetC58_1: JP3.2 ; port TEMP_MOTOR
NetJP2_2: JP2.2 ; port CAN.CANL
NetJP2_3: JP2.3 ; port CAN.CANH
NetJP4_8: JP4.8 ; port ADC_15
NetJP6_3: JP6.3 ; port SERVO

Not connected (* = marked no-connect by the designer): JP1 4(ID)*; JP7 3* 8*

### Buses and harness runs
bus HALL[1..3] = port HALL[1..3]
harness SPIS = port SPIS

### Library data of the parts
JP1 = USB_MICROB_SMT: pin to pad: 1>VBUS 2>D- 3>D+ 4>ID 5>GND 6>MT1+P$1+P$2+MT2; PartNumber: 10118192-0001LF; Manufacturer: Amphenol FCI; Mounting Technology: Surface Mount; PackageReference: USB - Micro B
JP2 = JST_PH_4_VERT: PartNumber: B4B-PH-K-S(LF)(SN); Manufacturer: JST Sales America Inc.; PackageReference: JST-PH; Mounting Technology: Through Hole
JP3 = JST_PH_6_VERT: PartNumber: B6B-PH-K-S(LF)(SN); Manufacturer: JST Sales America Inc.; PackageReference: JST-PH; Mounting Technology: Through Hole
JP4 = JST_PH_8_VERT: Manufacturer: JST Sales America Inc.; PartNumber: B8B-PH-K-S(LF)(SN); Mounting Technology: Through Hole; PackageReference: JST-PH
JP5 = MOLEX_5045_6: PartNumber: B6B-PH-K-S(LF)(SN); Manufacturer: JST Sales America Inc.; PackageReference: JST-PH; Mounting Technology: Through Hole
JP6 = Header 3: Header, 3-Pin; LatestRevisionDate: 17-Jul-2002; LatestRevisionNote: Re-released for DXP Platform.; Publisher: Altium Limited
JP7 = Header 4X2: Header, 4-Pin, Dual row; LatestRevisionDate: 17-Jul-2002; LatestRevisionNote: Re-released for DXP Platform.; Publisher: Altium Limited

## Sheet POWER.SchDoc
size A4
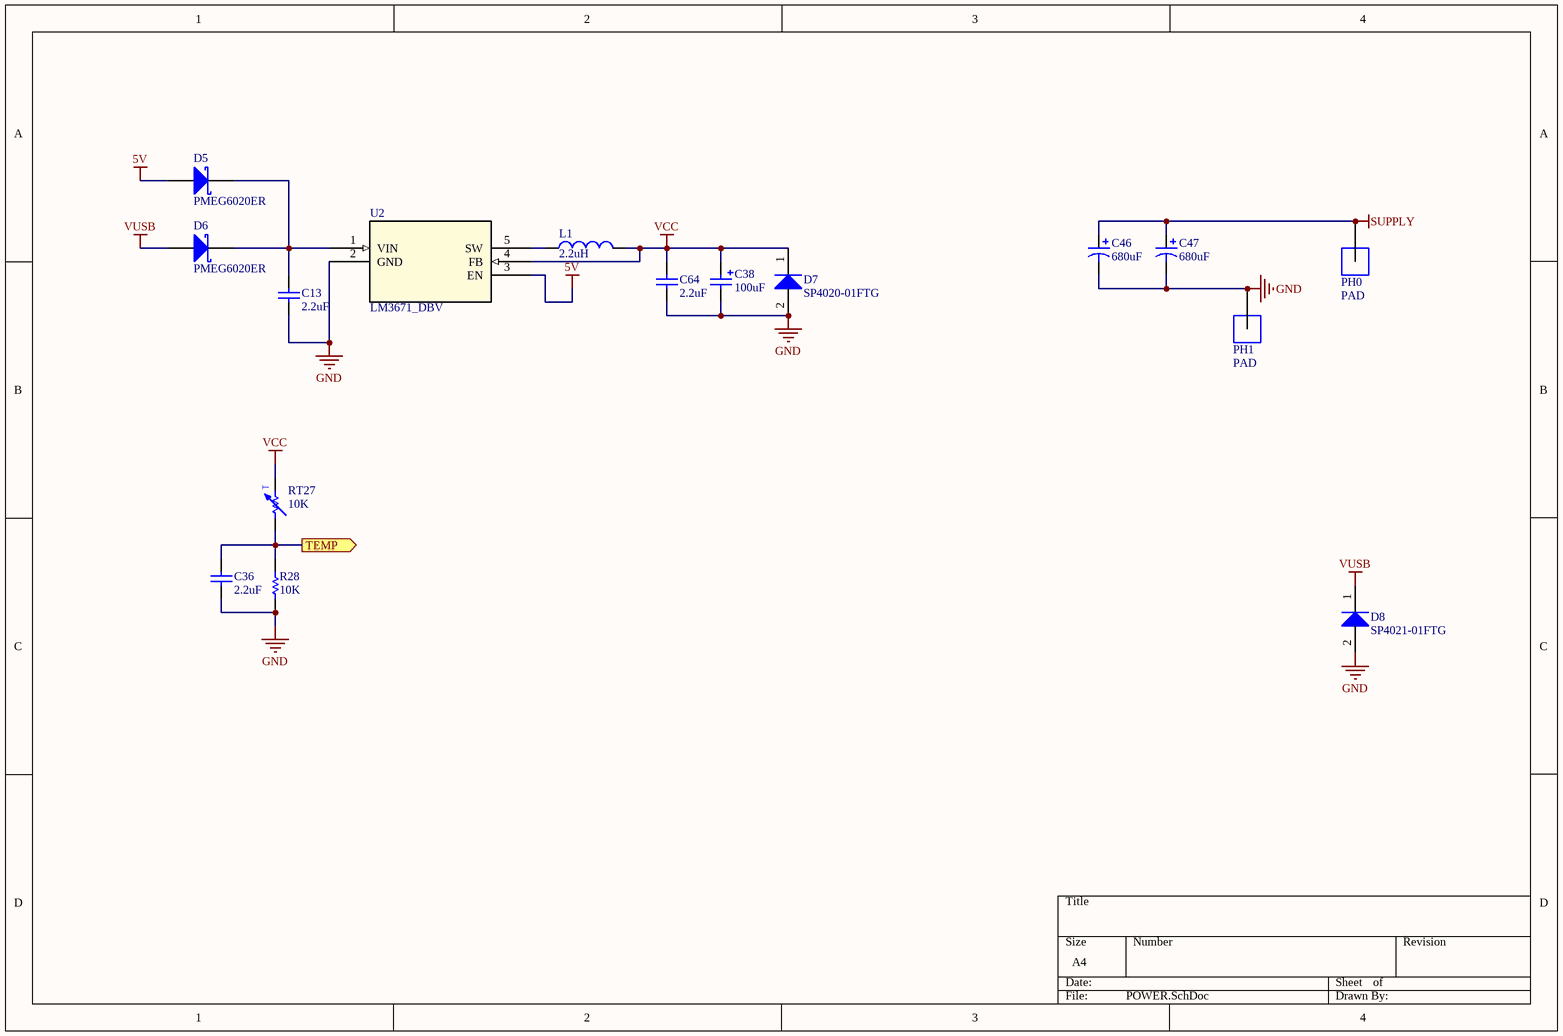
[diagram p6: POWER.SchDoc]

### Parts
C13  value 2.2uF  [C1206[3216X160]]  (hidden comment: 2.2uF 6.3V 1206)
C36  value 2.2uF  [C0603[1608X92]]  (hidden comment: 2.2uF 6.3V 0603)
C38  value 100uF  [C1206[3216X105]_Tantal]  (hidden comment: 100uF 16V 1206)
C46  value 680uF  [CAP_ELEC_THRU_5MM_HORZ]  (hidden comment: 680uF 63V)
C47  value 680uF  [CAP_ELEC_THRU_5MM_HORZ]  (hidden comment: 680uF 63V)
C64  value 2.2uF  [C1206[3216X160]]  (hidden comment: 2.2uF 6.3V 1206)
D5  PMEG6020ER  [SOD-123]
D6  PMEG6020ER  [SOD-123]
D7  SP4020-01FTG  [SOD-323]
D8  SP4021-01FTG  [SOD-323]
L1  2.2uH  [IND0805]
PH0  PAD  [PAD]
PH1  PAD  [PAD]
R28  value 10K  [R0603[1608]]  (hidden comment: 10K 1% 0603)
RT27  value 10K  [R0603[1608]]  (hidden comment: 10K 0.5% 0603)
U2  LM3671_DBV  [SOT23/MF05A]

### Ports
TEMP (out)

### Nets
5V: D5.2(A) U2.3(EN)
GND: C13.2 C36.1 C38.2 C46.2 C47.2 C64.2 D7.2(A) D8.2(A) PH1.0(PH) R28.1 U2.2(GND)
SUPPLY: C46.1 C47.1 PH0.0(PH)
VCC: C38.1 C64.1 D7.1(K) L1.2 RT27.2 U2.4(FB)
VUSB: D6.2(A) D8.1(K)
NetC13_1: C13.1 D5.1(K) D6.1(K) U2.1(VIN)
NetC36_2: C36.2 R28.2 RT27.1 ; port TEMP
NetL1_1: L1.1 U2.5(SW)

### Notes on the sheet
- (in symbol NTC_10K_0603_0.5%) T

### Library data of the parts
C13 C64 = CAP_2.2uF_16V_1206_10%: as C3 on sheet MCU; Mounting Technology: Surface Mount; PackageReference: 1206; PackageDescription: 1206 (3216 Metric); Tolerance: 10%
C36 = CAP_2.2uF_6.3V_0603_10%: as C35 on sheet POLL; Mounting Technology: Surface Mount; PackageReference: 0603; PackageDescription: 0603 (1608 Metric); Voltage: 6.3V; Tolerance: 10%
C38 = CAP_100uF_16V_1206_20%: as C21 on sheet DRV; Mounting Technology: Surface Mount; PackageReference: 1206; PackageDescription: 1206 (3216 Metric); Voltage: 16V; Tolerance: 20%
C46 C47 = CAP_680uF_63V_20%: 680uF 63V 20%  EC; PartNumber: EKZN630ELL681MK30S; Manufacturer: United Chemi-Con; Mounting Technology: Through Hall; PackageReference: 1H; PackageDescription: 12.5x31.5mm; Voltage: 63V; Tolerance: 20%
D5 D6 = PMEG6020ER: PartNumber: PMEG6020ER,115; Manufacturer: NXP Semiconductors; PackageReference: SOD-123W; PackageDescription: SOD, 2-Leads, Body 2.69x1.6mm; Mounting Technology: Surface Mount
D7 = SP4020-01FTG: Manufacturer: Littelfuse; PartNumber: SP4020-01FTG; PackageReference: SOD-323-2; Mounting Technology: Surface Mount
D8 = SP4021-01FTG: Manufacturer: Littelfuse; PartNumber: SP4021-01FTG; PackageReference: SOD-323-2; Mounting Technology: Surface Mount
L1 = IND_2.2uH_1.7A_0805_20%: 2.2uH 20% 1.7A 0805; PartNumber: LQM21PN2R2MGHL; Manufacturer: Murata; PackageReference: 0805; PackageDescription: 0805 (2012 metric); Mounting Technology: Surface Mount; Current: 1.7A; Value: 2.2uH
R28 = RES_10K_0603_1%: as R39 on sheet MCU; Tolerance: 1%; Power: 0.25W; Mounting Technology: Surface Mount; PackageReference: 0603; PackageDescription: 0603 (1608 Metric); ComponentLink1Description: Datasheet; ComponentLink1URL: http://www.vishay.com/docs/20065/rcse3.pdf
RT27 = NTC_10K_0603_0.5%: NTC 10K 0.5% 0603 (1608 Metric); PartNumber: NCP18XH103D60RC; Manufacturer: Murata; Power: 0.1W; Mounting Technology: Surface Mount; PackageReference: 0603; PackageDescription: 0603 (1608 Metric); Tolerance: 0.5%
U2 = LM3671_DBV: 600-mA Step-Down DC-DC Converter; Manufacturer: Texas Instruments; basePN: LM3671; DatasheetURL: http://www.ti.com/lit/ds/symlink/lm3671.pdf; Vendor: Texas Instruments; Value: Value; Type: Type; RefDes: RefDes; PackageReference: MF05A; PartNumber: LM3671_DBV

## Nets that join several sheets
5V: DRV (5 pins), CAN (C33.1 U4.3), Connectors (JP2.4 JP3.1 JP4.1 JP6.2), POWER (D5.2 U2.3)
GND: MCU (22 pins), DRV (28 pins), POLL1 (7 pins), POLL2 (7 pins), POLL3 (7 pins), CAN (C33.2 C34.1 U4.2 U4.8), Connectors (8 pins), POWER (11 pins)
SUPPLY: DRV (6 pins), POLL1 (POLL1_C37.2 POLL1_C39.2 POLL1_Q1.3), POLL2 (POLL2_C37.2 POLL2_C39.2 POLL2_Q1.3), POLL3 (POLL3_C37.2 POLL3_C39.2 POLL3_Q1.3), POWER (C46.1 C47.1 PH0.0)
VCC: MCU (17 pins), POLL1 (POLL1_C35.1 POLL1_U5.6 POLL1_U5.7), POLL2 (POLL2_C35.1 POLL2_U5.6 POLL2_U5.7), POLL3 (POLL3_C35.1 POLL3_U5.6 POLL3_U5.7), CAN (C34.2 U4.5), Connectors (JP4.2 JP5.1 JP7.2), POWER (6 pins)
VUSB: Connectors (JP1.1), POWER (D6.2 D8.1)
CURR1: MCU (U1.8), POLL1 (POLL1_C29.2 POLL1_R35.1)
CURR2: MCU (U1.9), POLL2 (POLL2_C29.2 POLL2_R35.1)
CURR3: MCU (U1.10), POLL3 (POLL3_C29.2 POLL3_R35.1)
GH1: DRV (U3.47), POLL1 (POLL1_R25.1)
GH2: DRV (U3.42), POLL2 (POLL2_R25.1)
GH3: DRV (U3.37), POLL3 (POLL3_R25.1)
GL1: DRV (U3.45), POLL1 (POLL1_R26.1)
GL2: DRV (U3.40), POLL2 (POLL2_R26.1)
GL3: DRV (U3.35), POLL3 (POLL3_R26.1)
HALL1: MCU (R44.2 U1.37), Connectors (JP3.5)
HALL2: MCU (R43.2 U1.38), Connectors (JP3.4)
HALL3: MCU (R42.2 U1.39), Connectors (JP3.3)
NetC36_2: MCU (U1.17), POWER (C36.2 R28.2 RT27.1)
NetC58_1: MCU (C58.1 R39.1 U1.24), Connectors (JP3.2)
NetJP2_2: CAN (U4.6), Connectors (JP2.2)
NetJP2_3: CAN (U4.7), Connectors (JP2.3)
NetJP4_8: MCU (U1.25), Connectors (JP4.8)
NetJP6_3: MCU (R6.1), Connectors (JP6.3)
NetR15_1: MCU (U1.11), DRV (R15.1 R16.1)
NetR17_1: MCU (U1.14), DRV (R17.1 R18.1)
NetR19_1: MCU (U1.15), DRV (R19.1 R20.1)
NetR21_1: MCU (U1.16), DRV (R21.1 R22.1)
NetU1_34: MCU (U1.34), DRV (U3.18)
NetU1_35: MCU (U1.35), DRV (U3.20)
NetU1_36: MCU (U1.36), DRV (U3.22)
NetU1_41: MCU (U1.41), DRV (U3.17)
NetU1_42: MCU (U1.42), DRV (U3.19)
NetU1_43: MCU (U1.43), DRV (U3.21)
NetU1_57: MCU (U1.57), DRV (U3.16)
NetU1_59: MCU (U1.59), DRV (U3.6)
SH1: DRV (C23.2 R17.2 U3.46), POLL1 (POLL1_Q1.2 POLL1_Q2.3 POLL1_R1.2)
SH2: DRV (C24.2 R19.2 U3.41), POLL2 (POLL2_Q1.2 POLL2_Q2.3 POLL2_R1.2)
SH3: DRV (C25.2 R21.2 U3.36), POLL3 (POLL3_Q1.2 POLL3_Q2.3 POLL3_R1.2)